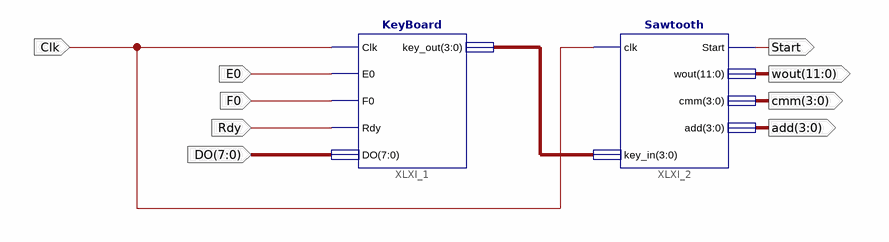
[diagram p0: schematic sheet 1]
// Xilinx ISE schematic SoundAndKeyboardSchema.sch (spartan3e) as structural Verilog: 2 symbols, 9 ports
module SoundAndKeyboardSchema (
  input  Clk,
  input  E0,
  input  F0,
  input  Rdy,
  input  [7:0] DO,
  output Start,
  output [11:0] wout,
  output [3:0] cmm,
  output [3:0] add
);

  wire [3:0] key;

  KeyBoard XLXI_1 (.Clk(Clk), .E0(E0), .F0(F0), .Rdy(Rdy), .DO(DO), .key_out(key));
  Sawtooth XLXI_2 (.clk(Clk), .Start(Start), .wout(wout), .cmm(cmm), .add(add), .key_in(key));
endmodule
